# Altium schematic sheet 68.Ethernet-GEPHY_RGMII1.SchDoc
size 420 x 297 mm; Revision: V2.1; Schematic Page Number: 11; Page Number: 32; Check: Default; Schematic Name: RK_NVR_DEMO1_RK3588_LP4/4x_V21; Page Count: 43; Page name: 68.Ethernet-GEPHY_RGMII1; Designer: Zhangdz; Schematic Page Count: 99; Revcode: V2.1; DsnPath: E:\Work\SBER\RK3588_SOM\temp\RK_NVR_DEMO1_RK3588_LP4XD200P232SD8_V21_20211228.DSN; SchematicName: RK_NVR_DEMO1_RK3588_LP4/4x_V21; PageName: 68.Ethernet-GEPHY_RGMII1; PageSize: A3; TopSchematic: True
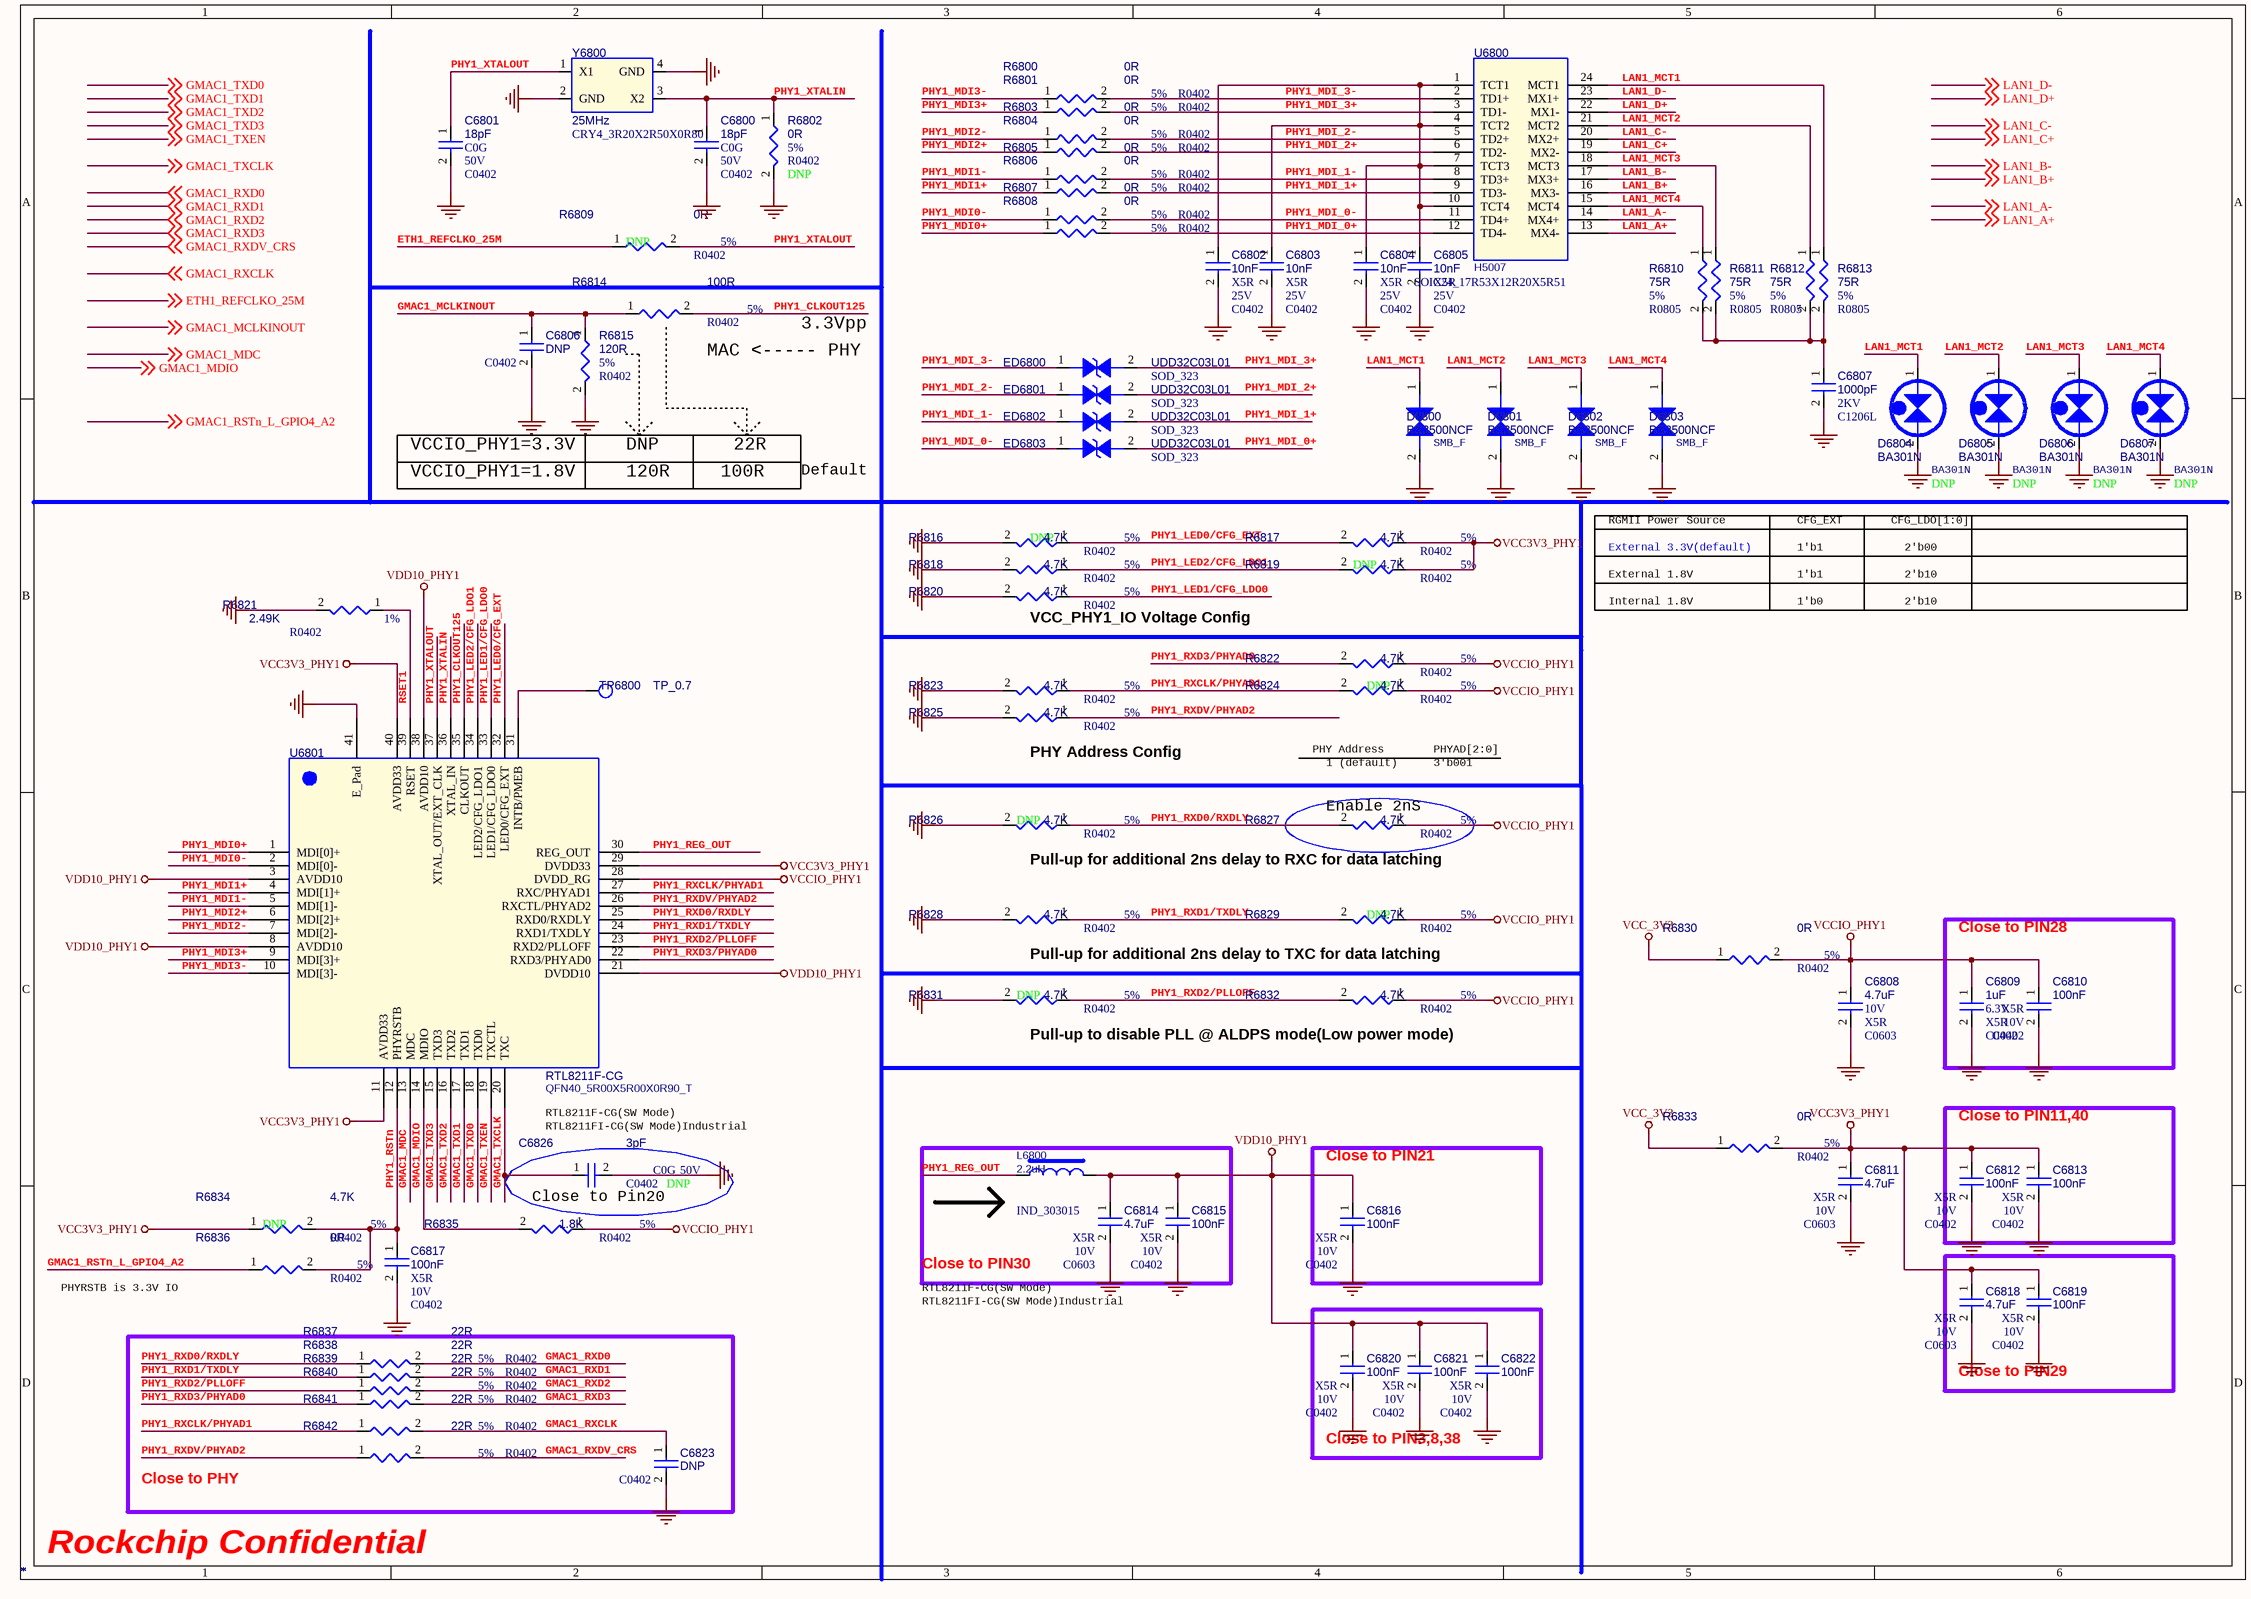
[diagram p0: 68.Ethernet-GEPHY_RGMII1.SchDoc]

## Parts
C6800  *  Voltage: 50V  Dielectric: C0G  [C0402]
C6801  *  Voltage: 50V  Dielectric: C0G  [C0402]
C6802  *  Voltage: 25V  Dielectric: X5R  [C0402]
C6803  *  Voltage: 25V  Dielectric: X5R  [C0402]
C6804  *  Voltage: 25V  Dielectric: X5R  [C0402]
C6805  *  Voltage: 25V  Dielectric: X5R  [C0402]
C6806  *  [C0402]
C6807  *  Voltage: 2KV  [C1206L]
C6808  *  Voltage: 10V  Dielectric: X5R  [C0603]
C6809  *  Voltage: 6.3V  Dielectric: X5R  [C0402]
C6810  *  Voltage: 10V  Dielectric: X5R  [C0402]
C6811  *  Voltage: 10V  Dielectric: X5R  [C0603]
C6812  *  Voltage: 10V  Dielectric: X5R  [C0402]
C6813  *  Voltage: 10V  Dielectric: X5R  [C0402]
C6814  *  Voltage: 10V  Dielectric: X5R  [C0603]
C6815  *  Voltage: 10V  Dielectric: X5R  [C0402]
C6816  *  Voltage: 10V  Dielectric: X5R  [C0402]
C6817  *  Voltage: 10V  Dielectric: X5R  [C0402]
C6818  *  Voltage: 10V  Dielectric: X5R  [C0603]
C6819  *  Voltage: 10V  Dielectric: X5R  [C0402]
C6820  *  Voltage: 10V  Dielectric: X5R  [C0402]
C6821  *  Voltage: 10V  Dielectric: X5R  [C0402]
C6822  *  Voltage: 10V  Dielectric: X5R  [C0402]
C6823  *  [C0402]
C6826  *  Voltage: 50V  Dielectric: C0G  option: DNP  [C0402]
D6800  *  PCB Footprint: SMB_F  [BA301N]
D6801  *  PCB Footprint: SMB_F  [BA301N]
D6802  *  PCB Footprint: SMB_F  [BA301N]
D6803  *  PCB Footprint: SMB_F  [BA301N]
D6804  *  option: DNP  [BA301N]
D6805  *  option: DNP  [BA301N]
D6806  *  option: DNP  [BA301N]
D6807  *  option: DNP  [BA301N]
ED6800  *  [SOD_323]
ED6801  *  [SOD_323]
ED6802  *  [SOD_323]
ED6803  *  [SOD_323]
L6800  *  [IND_303015]
R6800  *  Tolerance: 5%  [R0402]
R6801  *  Tolerance: 5%  [R0402]
R6802  *  Tolerance: 5%  option: DNP  [R0402]
R6803  *  Tolerance: 5%  [R0402]
R6804  *  Tolerance: 5%  [R0402]
R6805  *  Tolerance: 5%  [R0402]
R6806  *  Tolerance: 5%  [R0402]
R6807  *  Tolerance: 5%  [R0402]
R6808  *  Tolerance: 5%  [R0402]
R6809  *  Tolerance: 5%  Option: DNP  [R0402]
R6810  *  PCB Footprint: R0805  Tolerance: 5%  [R0402]
R6811  *  PCB Footprint: R0805  Tolerance: 5%  [R0402]
R6812  *  PCB Footprint: R0805  Tolerance: 5%  [R0402]
R6813  *  PCB Footprint: R0805  Tolerance: 5%  [R0402]
R6814  *  Tolerance: 5%  [R0402]
R6815  *  Tolerance: 5%  [R0402]
R6816  *  Tolerance: 5%  option: DNP  [R0402]
R6817  *  Tolerance: 5%  [R0402]
R6818  *  Tolerance: 5%  [R0402]
R6819  *  Tolerance: 5%  option: DNP  [R0402]
R6820  *  Tolerance: 5%  [R0402]
R6821  *  Tolerance: 1%  [R0402]
R6822  *  Tolerance: 5%  [R0402]
R6823  *  Tolerance: 5%  [R0402]
R6824  *  Tolerance: 5%  option: DNP  [R0402]
R6825  *  Tolerance: 5%  [R0402]
R6826  *  Tolerance: 5%  option: DNP  [R0402]
R6827  *  Tolerance: 5%  [R0402]
R6828  *  Tolerance: 5%  [R0402]
R6829  *  Tolerance: 5%  option: DNP  [R0402]
R6830  *  Tolerance: 5%  [R0402]
R6831  *  Tolerance: 5%  option: DNP  [R0402]
R6832  *  Tolerance: 5%  [R0402]
R6833  *  Tolerance: 5%  [R0402]
R6834  *  Tolerance: 5%  Option: DNP  [R0402]
R6835  *  Tolerance: 5%  [R0402]
R6836  *  Tolerance: 5%  [R0402]
R6837  *  Tolerance: 5%  [R0402]
R6838  *  Tolerance: 5%  [R0402]
R6839  *  Tolerance: 5%  [R0402]
R6840  *  Tolerance: 5%  [R0402]
R6841  *  Tolerance: 5%  [R0402]
R6842  *  Tolerance: 5%  [R0402]
TP6800  *  [TEST]
U6800  *  [SOIC24_17R53X12R20X5R51]
U6801  *  PCB Footprint: QFN40_5R00X5R00X0R90_T  [QFN40_5R00X5R00X0R80_T]
Y6800  *  PCB Footprint: CRY4_3R20X2R50X0R80  [CRY-3225]

## Blocks framed on the sheet
Close to PIN28: C6809 C6810
Close to PIN11,40: C6812 C6813
Close to PIN30: C6814 C6815 L6800
Close to PIN21: C6816
Close to PIN29: C6818 C6819
Close to PIN3,8,38: C6820-C6822
Close to PHY: C6823 R6837-R6842

## Nets
GND: C6800.2 C6801.2 C6802.2 C6803.2 C6804.2 C6805.2 C6806.2 C6807.2 C6808.2 C6809.2 C6810.2 C6811.2 C6812.2 C6813.2 C6814.2 C6815.2 C6816.2 C6817.2 C6818.2 C6819.2 C6820.2 C6821.2 C6822.2 C6823.2 C6826.2 D6800.2 D6801.2 D6802.2 D6803.2 D6804.2 D6805.2 D6806.2 D6807.2 R6802.2 R6815.2 R6816.2 R6818.2 R6820.2 R6821.2 R6823.2 R6825.2 R6826.2 R6828.2 R6831.2 U6801.41(E_Pad) Y6800.2(GND) Y6800.4(GND)
VCC3V3_PHY1: C6811.1 C6812.1 C6813.1 C6818.1 C6819.1 R6817.1 R6819.1 R6833.2 R6834.1 U6801.11(AVDD33) U6801.29(DVDD33) U6801.40(AVDD33)
VCC_3V3: R6830.1 R6833.1
VCCIO_PHY1: C6808.1 C6809.1 C6810.1 R6822.1 R6824.1 R6827.1 R6829.1 R6830.2 R6832.1 R6835.1 U6801.28(DVDD_RG)
VDD10_PHY1: C6814.1 C6815.1 C6816.1 C6820.1 C6821.1 C6822.1 L6800.2 U6801.3(AVDD10) U6801.8(AVDD10) U6801.21(DVDD10) U6801.38(AVDD10)
ETH1_REFCLKO_25M: R6809.1 ; off-sheet ETH1_REFCLKO_25M
GMAC1_MCLKINOUT: C6806.1 R6814.1 R6815.1 ; off-sheet GMAC1_MCLKINOUT
GMAC1_MDC: U6801.13(MDC) ; off-sheet GMAC1_MDC
GMAC1_MDIO: R6835.2 U6801.14(MDIO) ; off-sheet GMAC1_MDIO
GMAC1_RSTn_L_GPIO4_A2: R6836.1 ; off-sheet GMAC1_RSTn_L_GPIO4_A2
GMAC1_RXCLK: C6823.1 R6841.2 ; off-sheet GMAC1_RXCLK
GMAC1_RXD0: R6837.2 ; off-sheet GMAC1_RXD0
GMAC1_RXD1: R6838.2 ; off-sheet GMAC1_RXD1
GMAC1_RXD2: R6839.2 ; off-sheet GMAC1_RXD2
GMAC1_RXD3: R6840.2 ; off-sheet GMAC1_RXD3
GMAC1_RXDV_CRS: R6842.2 ; off-sheet GMAC1_RXDV_CRS
GMAC1_TXCLK: C6826.1 U6801.20(TXC) ; off-sheet GMAC1_TXCLK
GMAC1_TXD0: U6801.18(TXD0) ; off-sheet GMAC1_TXD0
GMAC1_TXD1: U6801.17(TXD1) ; off-sheet GMAC1_TXD1
GMAC1_TXD2: U6801.16(TXD2) ; off-sheet GMAC1_TXD2
GMAC1_TXD3: U6801.15(TXD3) ; off-sheet GMAC1_TXD3
GMAC1_TXEN: U6801.19(TXCTL) ; off-sheet GMAC1_TXEN
LAN1_A+: U6800.13(MX4-) ; off-sheet LAN1_A+
LAN1_A-: U6800.14(MX4+) ; off-sheet LAN1_A-
LAN1_B+: U6800.16(MX3-) ; off-sheet LAN1_B+
LAN1_B-: U6800.17(MX3+) ; off-sheet LAN1_B-
LAN1_C+: U6800.19(MX2-) ; off-sheet LAN1_C+
LAN1_C-: U6800.20(MX2+) ; off-sheet LAN1_C-
LAN1_D+: U6800.22(MX1-) ; off-sheet LAN1_D+
LAN1_D-: U6800.23(MX1+) ; off-sheet LAN1_D-
LAN1_MCT1: D6800.1 D6804.1 R6813.1 U6800.24(MCT1)
LAN1_MCT2: D6801.1 D6805.1 R6812.1 U6800.21(MCT2)
LAN1_MCT3: D6802.1 D6806.1 R6811.1 U6800.18(MCT3)
LAN1_MCT4: D6803.1 D6807.1 R6810.1 U6800.15(MCT4)
PHY1_CLKOUT125: R6814.2 U6801.35(CLKOUT)
PHY1_LED0/CFG_EXT: R6816.1 R6817.2 U6801.32(LED0/CFG_EXT)
PHY1_LED1/CFG_LDO0: R6820.1 U6801.33(LED1/CFG_LDO0)
PHY1_LED2/CFG_LDO1: R6818.1 R6819.2 U6801.34(LED2/CFG_LDO1)
PHY1_MDI0+: R6808.1 U6801.1(MDI[0]+)
PHY1_MDI0-: R6807.1 U6801.2(MDI[0]-)
PHY1_MDI1+: R6806.1 U6801.4(MDI[1]+)
PHY1_MDI1-: R6805.1 U6801.5(MDI[1]-)
PHY1_MDI2+: R6804.1 U6801.6(MDI[2]+)
PHY1_MDI2-: R6803.1 U6801.7(MDI[2]-)
PHY1_MDI3+: R6801.1 U6801.9(MDI[3]+)
PHY1_MDI3-: R6800.1 U6801.10(MDI[3]-)
PHY1_MDI_0+: ED6803.2 R6808.2 U6800.12(TD4-)
PHY1_MDI_0-: ED6803.1 R6807.2 U6800.11(TD4+)
PHY1_MDI_1+: ED6802.2 R6806.2 U6800.9(TD3-)
PHY1_MDI_1-: ED6802.1 R6805.2 U6800.8(TD3+)
PHY1_MDI_2+: ED6801.2 R6804.2 U6800.6(TD2-)
PHY1_MDI_2-: ED6801.1 R6803.2 U6800.5(TD2+)
PHY1_MDI_3+: ED6800.2 R6801.2 U6800.3(TD1-)
PHY1_MDI_3-: ED6800.1 R6800.2 U6800.2(TD1+)
PHY1_REG_OUT: L6800.1 U6801.30(REG_OUT)
PHY1_RSTn: C6817.1 R6834.2 R6836.2 U6801.12(PHYRSTB)
PHY1_RXCLK/PHYAD1: R6823.1 R6824.2 R6841.1 U6801.27(RXC/PHYAD1)
PHY1_RXD0/RXDLY: R6826.1 R6827.2 R6837.1 U6801.25(RXD0/RXDLY)
PHY1_RXD1/TXDLY: R6828.1 R6829.2 R6838.1 U6801.24(RXD1/TXDLY)
PHY1_RXD2/PLLOFF: R6831.1 R6832.2 R6839.1 U6801.23(RXD2/PLLOFF)
PHY1_RXD3/PHYAD0: R6822.2 R6840.1 U6801.22(RXD3/PHYAD0)
PHY1_RXDV/PHYAD2: R6825.1 R6842.1 U6801.26(RXCTL/PHYAD2)
PHY1_XTALIN: C6800.1 R6802.1 U6801.36(XTAL_IN) Y6800.3(X2)
PHY1_XTALOUT: C6801.1 R6809.2 U6801.37(XTAL_OUT/EXT_CLK) Y6800.1(X1)
RSET1: R6821.1 U6801.39(RSET)
NetC6802_1: C6802.1 C6803.1 C6804.1 C6805.1 U6800.1(TCT1) U6800.4(TCT2) U6800.7(TCT3) U6800.10(TCT4)
NetC6807_1: C6807.1 R6810.2 R6811.2 R6812.2 R6813.2
NetTP6800_1: TP6800.1 U6801.31(INTB/PMEB)

## Notes on the sheet
- (near R6814) MAC <----- PHY
- 3.3Vpp
- VCCIO_PHY1=3.3V
- DNP
- 22R
- VCCIO_PHY1=1.8V
- 120R
- 100R
- Default
- RGMII Power Source
- CFG_EXT
- CFG_LDO[1:0]
- External 3.3V(default)
- External 1.8V
- 1'b1
- 2'b00
- 2'b10
- (near R6820) VCC_PHY1_IO Voltage Config
- Internal 1.8V
- 1'b0
- (near R6825) PHY Address Config
- PHY Address
- 1 (default)
- PHYAD[2:0]
- 3'b001
- Pull-up for additional 2ns delay to RXC for data latching
- (near R6827) Enable 2nS
- Pull-up for additional 2ns delay to TXC for data latching
- Pull-up to disable PLL @ ALDPS mode(Low power mode)
- RTL8211F-CG(SW Mode)
- RTL8211FI-CG(SW Mode)Industrial
- Close to Pin20
- PHYRSTB is 3.3V IO
- Rockchip Confidential

## Library data of the parts
C6800 = CAP NP: cap,18.00pF,+/-5%,50V,C0G,C0402; Part Reference: C6800; Manufacturer: TDK; Value: 18pF; RK PN: C1005C0G1H180J050BA; Priority: A; Tolerance: 5%; PCB Footprint: C0402; Part Type: C0402; Manufacturer PN: C1005C0G1H180J050BA; Created by: JJJ
C6801 = CAP NP: cap,18.00pF,+/-5%,50V,C0G,C0402; Part Reference: C6801; Manufacturer: TDK; Value: 18pF; RK PN: C1005C0G1H180J050BA; Priority: A; Tolerance: 5%; PCB Footprint: C0402; Part Type: C0402; Manufacturer PN: C1005C0G1H180J050BA; Created by: JJJ
C6802 = CAP NP: cap,10.00nF,+/-10%,25V,X5R,C0402; Part Reference: C6802; Manufacturer PN: C1005X5R1E103K050BA; Manufacturer: TDK; Value: 10nF; Tolerance: 10%; Priority: A; PCB Footprint: C0402; Created by: JJJ; Part Type: C0402; RK PN: C1005X5R1E103K050BA
C6803 = CAP NP: cap,10.00nF,+/-10%,25V,X5R,C0402; Part Reference: C6803; Manufacturer PN: C1005X5R1E103K050BA; Manufacturer: TDK; Value: 10nF; Tolerance: 10%; Priority: A; PCB Footprint: C0402; Created by: JJJ; Part Type: C0402; RK PN: C1005X5R1E103K050BA
C6804 = CAP NP: cap,10.00nF,+/-10%,25V,X5R,C0402; Part Reference: C6804; Manufacturer: TDK; Value: 10nF; RK PN: C1005X5R1E103K050BA; Priority: A; Tolerance: 10%; PCB Footprint: C0402; Part Type: C0402; Manufacturer PN: C1005X5R1E103K050BA; Created by: JJJ
C6805 = CAP NP: cap,10.00nF,+/-10%,25V,X5R,C0402; Part Reference: C6805; Manufacturer: TDK; Value: 10nF; RK PN: C1005X5R1E103K050BA; Priority: A; Tolerance: 10%; PCB Footprint: C0402; Part Type: C0402; Manufacturer PN: C1005X5R1E103K050BA; Created by: JJJ
C6806 = CAP NP: Did Not Place.; Part Reference: C6806; Value: DNP; Number: 37; RK PN: DNPC0402; Priority: A; C_Voltage: 6.3V; PCB Footprint: C0402; Part Type: DNP; Manufacturer PN: DNPC0402; Created by: JJJ
C6807 = CAP NP: ёЯС№µзИЭ,1000pF/2KV,C1206; Part Reference: C6807; Value: 1000pF; RK PN: CTY1AC250V2E4102M2B; Priority: A; Tolerance: 20%; PCB Footprint: C1206L; Part Type: ёЯС№µзИЭ; Manufacturer PN: CTY1AC250V2E4102M2B; Created by: JJJ
C6808 = CAP NP: cap,4.70uF,+/-10%,10V,X5R,C0603; Part Reference: C6808; Manufacturer: TDK; Value: 4.7uF; RK PN: C1608X5R1A475K080AC; Priority: A; C_Voltage: 6.3V; Tolerance: 10%; PCB Footprint: C0603; Part Type: C0603; Manufacturer PN: C1608X5R1A475K080AC; Created by: JJJ
C6809 = CAP NP: cap,1.00uF,+/-10%,6.3V,X5R,C0402; Part Reference: C6809; Manufacturer: TDK; Value: 1uF; RK PN: C1005X5R0J105K050BB; Priority: A; Tolerance: 10%; PCB Footprint: C0402; Part Type: C0402; C_Voltage: 6.3V; Manufacturer PN: C1005X5R0J105K050BB; Created by: JJJ
C6810 = CAP NP: cap,100.00nF,+/-10%,10V,X5R,C0402; Part Reference: C6810; Manufacturer: TDK; Value: 100nF; Number: 37; RK PN: C1005X5R1A104K050BA; Priority: A; Tolerance: 10%; C_Voltage: 6.3V; PCB Footprint: C0402; Part Type: C0402; Manufacturer PN: C1005X5R1A104K050BA; Created by: JJJ
C6811 = CAP NP: cap,4.70uF,+/-10%,10V,X5R,C0603; Part Reference: C6811; Manufacturer PN: C1608X5R1A475K080AC; Manufacturer: TDK; Value: 4.7uF; Tolerance: 10%; C_Voltage: 6.3V; Priority: A; PCB Footprint: C0603; Created by: JJJ; Part Type: C0603; RK PN: C1608X5R1A475K080AC
C6812 = CAP NP: cap,100.00nF,+/-10%,10V,X5R,C0402; Part Reference: C6812; Manufacturer: TDK; Value: 100nF; Number: 37; RK PN: C1005X5R1A104K050BA; Priority: A; Tolerance: 10%; C_Voltage: 6.3V; PCB Footprint: C0402; Part Type: C0402; Manufacturer PN: C1005X5R1A104K050BA; Created by: JJJ
C6813 = CAP NP: cap,100.00nF,+/-10%,10V,X5R,C0402; Part Reference: C6813; Manufacturer: TDK; Value: 100nF; Number: 37; RK PN: C1005X5R1A104K050BA; Priority: A; Tolerance: 10%; C_Voltage: 6.3V; PCB Footprint: C0402; Part Type: C0402; Manufacturer PN: C1005X5R1A104K050BA; Created by: JJJ
C6814 = CAP NP: cap,4.70uF,+/-10%,10V,X5R,C0603; Part Reference: C6814; Manufacturer PN: C1608X5R1A475K080AC; Manufacturer: TDK; Value: 4.7uF; Tolerance: 10%; C_Voltage: 6.3V; Priority: A; PCB Footprint: C0603; Created by: JJJ; Part Type: C0603; RK PN: C1608X5R1A475K080AC
C6815 = CAP NP: cap,100.00nF,+/-10%,10V,X5R,C0402; Part Reference: C6815; Manufacturer PN: C1005X5R1A104K050BA; Manufacturer: TDK; Value: 100nF; C_Voltage: 6.3V; Tolerance: 10%; Priority: A; Number: 37; PCB Footprint: C0402; Created by: JJJ; Part Type: C0402; RK PN: C1005X5R1A104K050BA
C6816 = CAP NP: cap,100.00nF,+/-10%,10V,X5R,C0402; Part Reference: C6816; Manufacturer PN: C1005X5R1A104K050BA; Manufacturer: TDK; Value: 100nF; C_Voltage: 6.3V; Tolerance: 10%; Priority: A; Number: 37; PCB Footprint: C0402; Created by: JJJ; Part Type: C0402; RK PN: C1005X5R1A104K050BA
C6817 = CAP NP: cap,100.00nF,+/-10%,10V,X5R,C0402; Part Reference: C6817; Manufacturer PN: C1005X5R1A104K050BA; Manufacturer: TDK; Value: 100nF; Tolerance: 10%; Priority: A; PCB Footprint: C0402; Created by: JJJ; Part Type: C0402; RK PN: C1005X5R1A104K050BA
C6818 = CAP NP: cap,4.70uF,+/-10%,10V,X5R,C0603; Part Reference: C6818; Manufacturer PN: C1608X5R1A475K080AC; Manufacturer: TDK; Value: 4.7uF; Tolerance: 10%; C_Voltage: 6.3V; Priority: A; PCB Footprint: C0603; Created by: JJJ; Part Type: C0603; RK PN: C1608X5R1A475K080AC
C6819 = CAP NP: cap,100.00nF,+/-10%,10V,X5R,C0402; Part Reference: C6819; Manufacturer: TDK; Value: 100nF; Number: 37; RK PN: C1005X5R1A104K050BA; Priority: A; Tolerance: 10%; C_Voltage: 6.3V; PCB Footprint: C0402; Part Type: C0402; Manufacturer PN: C1005X5R1A104K050BA; Created by: JJJ
C6820 = CAP NP: cap,100.00nF,+/-10%,10V,X5R,C0402; Part Reference: C6820; Manufacturer: TDK; Value: 100nF; Number: 37; RK PN: C1005X5R1A104K050BA; Priority: A; Tolerance: 10%; C_Voltage: 6.3V; PCB Footprint: C0402; Part Type: C0402; Manufacturer PN: C1005X5R1A104K050BA; Created by: JJJ
C6821 = CAP NP: cap,100.00nF,+/-10%,10V,X5R,C0402; Part Reference: C6821; Manufacturer: TDK; Value: 100nF; Number: 37; RK PN: C1005X5R1A104K050BA; Priority: A; Tolerance: 10%; C_Voltage: 6.3V; PCB Footprint: C0402; Part Type: C0402; Manufacturer PN: C1005X5R1A104K050BA; Created by: JJJ
C6822 = CAP NP: cap,100.00nF,+/-10%,10V,X5R,C0402; Part Reference: C6822; Manufacturer: TDK; Value: 100nF; Number: 37; RK PN: C1005X5R1A104K050BA; Priority: A; Tolerance: 10%; C_Voltage: 6.3V; PCB Footprint: C0402; Part Type: C0402; Manufacturer PN: C1005X5R1A104K050BA; Created by: JJJ
C6823 = CAP NP: Did Not Place.; Part Reference: C6823; Manufacturer PN: DNPC0402; Value: DNP; C_Voltage: 6.3V; Priority: A; Number: 37; PCB Footprint: C0402; Created by: JJJ; Part Type: DNP; RK PN: DNPC0402
C6826 = CAP NP: cap,3.00pF,+/-0.25,50V,C0G,C0402; Part Reference: C6826; Manufacturer: TDK; Value: 3pF; RK PN: C1005C0G1H030C050BA; Priority: A; Tolerance: +/-0.25pF; PCB Footprint: C0402; Part Type: C0402; Manufacturer PN: C1005C0G1H030C050BA; Created by: JJJ
D6800 = BA301N_3: Part Reference: D6800; Value: BS3500NCF
D6801 = BA301N_3: Part Reference: D6801; Value: BS3500NCF
D6802 = BA301N_3: Part Reference: D6802; Value: BS3500NCF
D6803 = BA301N_3: Part Reference: D6803; Value: BS3500NCF
D6804 = BA301N_1: Part Reference: D6804; Value: BA301N; PCB Footprint: BA301N
D6805 = BA301N_1: Part Reference: D6805; Value: BA301N; PCB Footprint: BA301N
D6806 = BA301N_1: Part Reference: D6806; Value: BA301N; PCB Footprint: BA301N
D6807 = BA301N_1: Part Reference: D6807; Value: BA301N; PCB Footprint: BA301N
ED6800 = DIODE BI_DIR TRIG: Transient Voltage Suppressor,0.8pF; Part Reference: ED6800; Manufacturer: WillSemi(О¤¶ы°лµјМе); Value: UDD32C03L01; RK PN: ESD5451N; Priority: A; PCB Footprint: SOD_323; Part Type: ESD_TVS; Manufacturer PN: ESD5451N; Created by: JJJ
ED6801 = DIODE BI_DIR TRIG: Transient Voltage Suppressor,0.8pF; Part Reference: ED6801; Manufacturer: WillSemi(О¤¶ы°лµјМе); Value: UDD32C03L01; RK PN: ESD5451N; Priority: A; PCB Footprint: SOD_323; Part Type: ESD_TVS; Manufacturer PN: ESD5451N; Created by: JJJ
ED6802 = DIODE BI_DIR TRIG: Transient Voltage Suppressor,0.8pF; Part Reference: ED6802; Manufacturer: WillSemi(О¤¶ы°лµјМе); Value: UDD32C03L01; RK PN: ESD5451N; Priority: A; PCB Footprint: SOD_323; Part Type: ESD_TVS; Manufacturer PN: ESD5451N; Created by: JJJ
ED6803 = DIODE BI_DIR TRIG: Transient Voltage Suppressor,0.8pF; Part Reference: ED6803; Manufacturer: WillSemi(О¤¶ы°лµјМе); Value: UDD32C03L01; RK PN: ESD5451N; Priority: A; PCB Footprint: SOD_323; Part Type: ESD_TVS; Manufacturer PN: ESD5451N; Created by: JJJ
L6800 = INDUCTORS OF FERRITE_Dup1: Power Inductor,2.2uH,0.3,IND_303015; Part Reference: L6800; Manufacturer PN: SWPA3015S2R2NT; Manufacturer: sunlord; Isat: 1.6A; DC Resistor: 0.06ohm; Resonace frequency: 86M; Tolerance: 30%; Priority: A; PCB Footprint: IND_303015; Value: 2.2uH; Created by: YTL; Irms: 1.6A; Part Type: POWER_IND; RK PN: SWPA3015S2R2NT
R6800 = RESISTOR_Dup1: НЁУГєсД¤µзЧи,0R,+/-5%,R0402,1/16W.; Part Reference: R6800; Manufacturer: YAGEO; RK PN: RC0402JR-070RL; Priority: A; Wattage: 1/16W; PCB Footprint: R0402; Value: 0R; Part Type: НЁУГєсД¤µзЧи; Manufacturer PN: RC0402JR-070RL; Created by: YTL
R6801 = RESISTOR_Dup1: НЁУГєсД¤µзЧи,0R,+/-5%,R0402,1/16W.; Part Reference: R6801; Manufacturer: YAGEO; RK PN: RC0402JR-070RL; Priority: A; Wattage: 1/16W; PCB Footprint: R0402; Value: 0R; Part Type: НЁУГєсД¤µзЧи; Manufacturer PN: RC0402JR-070RL; Created by: YTL
R6802 = RESISTOR_Dup1: НЁУГєсД¤µзЧи,0R,+/-5%,R0402,1/16W.; Part Reference: R6802; Manufacturer: YAGEO; RK PN: RC0402JR-070RL; Priority: A; Wattage: 1/16W; PCB Footprint: R0402; Value: 0R; Part Type: НЁУГєсД¤µзЧи; Manufacturer PN: RC0402JR-070RL; Created by: YTL
R6803 = RESISTOR_Dup1: НЁУГєсД¤µзЧи,0R,+/-5%,R0402,1/16W.; Part Reference: R6803; Manufacturer: YAGEO; RK PN: RC0402JR-070RL; Priority: A; Wattage: 1/16W; PCB Footprint: R0402; Value: 0R; Part Type: НЁУГєсД¤µзЧи; Manufacturer PN: RC0402JR-070RL; Created by: YTL
R6804 = RESISTOR_Dup1: НЁУГєсД¤µзЧи,0R,+/-5%,R0402,1/16W.; Part Reference: R6804; Manufacturer: YAGEO; RK PN: RC0402JR-070RL; Priority: A; Wattage: 1/16W; PCB Footprint: R0402; Value: 0R; Part Type: НЁУГєсД¤µзЧи; Manufacturer PN: RC0402JR-070RL; Created by: YTL
R6805 = RESISTOR_Dup1: НЁУГєсД¤µзЧи,0R,+/-5%,R0402,1/16W.; Part Reference: R6805; Manufacturer: YAGEO; RK PN: RC0402JR-070RL; Priority: A; Wattage: 1/16W; PCB Footprint: R0402; Value: 0R; Part Type: НЁУГєсД¤µзЧи; Manufacturer PN: RC0402JR-070RL; Created by: YTL
R6806 = RESISTOR_Dup1: НЁУГєсД¤µзЧи,0R,+/-5%,R0402,1/16W.; Part Reference: R6806; Manufacturer: YAGEO; RK PN: RC0402JR-070RL; Priority: A; Wattage: 1/16W; PCB Footprint: R0402; Value: 0R; Part Type: НЁУГєсД¤µзЧи; Manufacturer PN: RC0402JR-070RL; Created by: YTL
R6807 = RESISTOR_Dup1: НЁУГєсД¤µзЧи,0R,+/-5%,R0402,1/16W.; Part Reference: R6807; Manufacturer: YAGEO; RK PN: RC0402JR-070RL; Priority: A; Wattage: 1/16W; PCB Footprint: R0402; Value: 0R; Part Type: НЁУГєсД¤µзЧи; Manufacturer PN: RC0402JR-070RL; Created by: YTL
R6808 = RESISTOR_Dup1: НЁУГєсД¤µзЧи,0R,+/-5%,R0402,1/16W.; Part Reference: R6808; Manufacturer: YAGEO; RK PN: RC0402JR-070RL; Priority: A; Wattage: 1/16W; PCB Footprint: R0402; Value: 0R; Part Type: НЁУГєсД¤µзЧи; Manufacturer PN: RC0402JR-070RL; Created by: YTL
R6809 = RESISTOR_Dup1: НЁУГєсД¤µзЧи,0R,+/-5%,R0402,1/16W.; Part Reference: R6809; Manufacturer: YAGEO; RK PN: RC0402JR-070RL; Priority: A; Wattage: 1/16W; PCB Footprint: R0402; Value: 0R; Part Type: НЁУГєсД¤µзЧи; Manufacturer PN: RC0402JR-070RL; Created by: YTL
R6810 = RESISTOR_Dup1: НЁУГєсД¤µзЧи,75R,+/-5%,R0805,1/8W.; Part Reference: R6810; Manufacturer PN: RC0805JR-0775RL; Manufacturer: YAGEO; Wattage: 1/8W; Priority: A; Value: 75R; Created by: YTL; Part Type: НЁУГєсД¤µзЧи; RK PN: RC0805JR-0775RL
R6811 = RESISTOR_Dup1: НЁУГєсД¤µзЧи,75R,+/-5%,R0805,1/8W.; Part Reference: R6811; Manufacturer PN: RC0805JR-0775RL; Manufacturer: YAGEO; Wattage: 1/8W; Priority: A; Value: 75R; Created by: YTL; Part Type: НЁУГєсД¤µзЧи; RK PN: RC0805JR-0775RL
R6812 = RESISTOR_Dup1: НЁУГєсД¤µзЧи,75R,+/-5%,R0805,1/8W.; Part Reference: R6812; Manufacturer PN: RC0805JR-0775RL; Manufacturer: YAGEO; Wattage: 1/8W; Priority: A; Value: 75R; Created by: YTL; Part Type: НЁУГєсД¤µзЧи; RK PN: RC0805JR-0775RL
R6813 = RESISTOR_Dup1: НЁУГєсД¤µзЧи,75R,+/-5%,R0805,1/8W.; Part Reference: R6813; Manufacturer PN: RC0805JR-0775RL; Manufacturer: YAGEO; Wattage: 1/8W; Priority: A; Value: 75R; Created by: YTL; Part Type: НЁУГєсД¤µзЧи; RK PN: RC0805JR-0775RL
R6814 = RESISTOR_Dup1: НЁУГєсД¤µзЧи,100R,+/-5%,R0402,1/16W.; Part Reference: R6814; Manufacturer PN: RC0402JR-07100RL; Manufacturer: YAGEO; Wattage: 1/16W; Priority: A; PCB Footprint: R0402; Value: 100R; Created by: YTL; Part Type: НЁУГєсД¤µзЧи; RK PN: RC0402JR-07100RL
R6815 = RESISTOR_Dup1: НЁУГєсД¤µзЧи,120R,+/-5%,R0402,1/16W.; Part Reference: R6815; Manufacturer: YAGEO; RK PN: RC0402JR-07120RL; Priority: A; Wattage: 1/16W; PCB Footprint: R0402; Value: 120R; Part Type: НЁУГєсД¤µзЧи; Manufacturer PN: RC0402JR-07120RL; Created by: YTL
R6816 = RESISTOR_Dup1: НЁУГєсД¤µзЧи,4K7,+/-5%,R0402,1/16W.; Part Reference: R6816; Manufacturer: YAGEO; Value: 4.7K; RK PN: RC0402JR-074K7L; Priority: A; Wattage: 1/16W; PCB Footprint: R0402; Part Type: НЁУГєсД¤µзЧи; Manufacturer PN: RC0402JR-074K7L; Created by: YTL
R6817 = RESISTOR_Dup1: НЁУГєсД¤µзЧи,4K7,+/-5%,R0402,1/16W.; Part Reference: R6817; Manufacturer: YAGEO; Value: 4.7K; RK PN: RC0402JR-074K7L; Priority: A; Wattage: 1/16W; PCB Footprint: R0402; Part Type: НЁУГєсД¤µзЧи; Manufacturer PN: RC0402JR-074K7L; Created by: YTL
R6818 = RESISTOR_Dup1: НЁУГєсД¤µзЧи,4K7,+/-5%,R0402,1/16W.; Part Reference: R6818; Manufacturer: YAGEO; Value: 4.7K; RK PN: RC0402JR-074K7L; Priority: A; Wattage: 1/16W; PCB Footprint: R0402; Part Type: НЁУГєсД¤µзЧи; Manufacturer PN: RC0402JR-074K7L; Created by: YTL
R6819 = RESISTOR_Dup1: НЁУГєсД¤µзЧи,4K7,+/-5%,R0402,1/16W.; Part Reference: R6819; Manufacturer PN: RC0402JR-074K7L; Manufacturer: YAGEO; Value: 4.7K; Wattage: 1/16W; Priority: A; PCB Footprint: R0402; Created by: YTL; Part Type: НЁУГєсД¤µзЧи; RK PN: RC0402JR-074K7L
R6820 = RESISTOR_Dup1: НЁУГєсД¤µзЧи,4K7,+/-5%,R0402,1/16W.; Part Reference: R6820; Manufacturer PN: RC0402JR-074K7L; Manufacturer: YAGEO; Value: 4.7K; Wattage: 1/16W; Priority: A; PCB Footprint: R0402; Created by: YTL; Part Type: НЁУГєсД¤µзЧи; RK PN: RC0402JR-074K7L
R6821 = RESISTOR_Dup1: НЁУГєсД¤µзЧи,2K49,+/-1%,R0402,1/16W.; Part Reference: R6821; Manufacturer PN: RC0402FR-072K49L; Manufacturer: YAGEO; Value: 2.49K; Wattage: 1/16W; Priority: A; PCB Footprint: R0402; Created by: YTL; Part Type: НЁУГєсД¤µзЧи; RK PN: RC0402FR-072K49L
R6822 = RESISTOR_Dup1: НЁУГєсД¤µзЧи,4K7,+/-5%,R0402,1/16W.; Part Reference: R6822; Manufacturer: YAGEO; Value: 4.7K; RK PN: RC0402JR-074K7L; Priority: A; Wattage: 1/16W; PCB Footprint: R0402; Part Type: НЁУГєсД¤µзЧи; Manufacturer PN: RC0402JR-074K7L; Created by: YTL
R6823 = RESISTOR_Dup1: НЁУГєсД¤µзЧи,4K7,+/-5%,R0402,1/16W.; Part Reference: R6823; Manufacturer PN: RC0402JR-074K7L; Manufacturer: YAGEO; Value: 4.7K; Wattage: 1/16W; Priority: A; PCB Footprint: R0402; Created by: YTL; Part Type: НЁУГєсД¤µзЧи; RK PN: RC0402JR-074K7L
R6824 = RESISTOR_Dup1: НЁУГєсД¤µзЧи,4K7,+/-5%,R0402,1/16W.; Part Reference: R6824; Manufacturer: YAGEO; Value: 4.7K; RK PN: RC0402JR-074K7L; Priority: A; Wattage: 1/16W; PCB Footprint: R0402; Part Type: НЁУГєсД¤µзЧи; Manufacturer PN: RC0402JR-074K7L; Created by: YTL
R6825 = RESISTOR_Dup1: НЁУГєсД¤µзЧи,4K7,+/-5%,R0402,1/16W.; Part Reference: R6825; Manufacturer PN: RC0402JR-074K7L; Manufacturer: YAGEO; Value: 4.7K; Wattage: 1/16W; Priority: A; PCB Footprint: R0402; Created by: YTL; Part Type: НЁУГєсД¤µзЧи; RK PN: RC0402JR-074K7L
R6826 = RESISTOR_Dup1: НЁУГєсД¤µзЧи,4K7,+/-5%,R0402,1/16W.; Part Reference: R6826; Manufacturer PN: RC0402JR-074K7L; Manufacturer: YAGEO; Value: 4.7K; Wattage: 1/16W; Priority: A; PCB Footprint: R0402; Created by: YTL; Part Type: НЁУГєсД¤µзЧи; RK PN: RC0402JR-074K7L
R6827 = RESISTOR_Dup1: НЁУГєсД¤µзЧи,4K7,+/-5%,R0402,1/16W.; Part Reference: R6827; Manufacturer: YAGEO; Value: 4.7K; RK PN: RC0402JR-074K7L; Priority: A; Wattage: 1/16W; PCB Footprint: R0402; Part Type: НЁУГєсД¤µзЧи; Manufacturer PN: RC0402JR-074K7L; Created by: YTL
R6828 = RESISTOR_Dup1: НЁУГєсД¤µзЧи,4K7,+/-5%,R0402,1/16W.; Part Reference: R6828; Manufacturer PN: RC0402JR-074K7L; Manufacturer: YAGEO; Value: 4.7K; Wattage: 1/16W; Priority: A; PCB Footprint: R0402; Created by: YTL; Part Type: НЁУГєсД¤µзЧи; RK PN: RC0402JR-074K7L
R6829 = RESISTOR_Dup1: НЁУГєсД¤µзЧи,4K7,+/-5%,R0402,1/16W.; Part Reference: R6829; Manufacturer: YAGEO; Value: 4.7K; RK PN: RC0402JR-074K7L; Priority: A; Wattage: 1/16W; PCB Footprint: R0402; Part Type: НЁУГєсД¤µзЧи; Manufacturer PN: RC0402JR-074K7L; Created by: YTL
R6830 = RESISTOR_Dup1: НЁУГєсД¤µзЧи,0R,+/-5%,R0402,1/16W.; Part Reference: R6830; Manufacturer PN: RC0402JR-070RL; Manufacturer: YAGEO; Wattage: 1/16W; Priority: A; PCB Footprint: R0402; Value: 0R; Created by: YTL; Part Type: НЁУГєсД¤µзЧи; RK PN: RC0402JR-070RL
R6831 = RESISTOR_Dup1: НЁУГєсД¤µзЧи,4K7,+/-5%,R0402,1/16W.; Part Reference: R6831; Manufacturer PN: RC0402JR-074K7L; Manufacturer: YAGEO; Value: 4.7K; Wattage: 1/16W; Priority: A; PCB Footprint: R0402; Created by: YTL; Part Type: НЁУГєсД¤µзЧи; RK PN: RC0402JR-074K7L
R6832 = RESISTOR_Dup1: НЁУГєсД¤µзЧи,4K7,+/-5%,R0402,1/16W.; Part Reference: R6832; Manufacturer PN: RC0402JR-074K7L; Manufacturer: YAGEO; Value: 4.7K; Wattage: 1/16W; Priority: A; PCB Footprint: R0402; Created by: YTL; Part Type: НЁУГєсД¤µзЧи; RK PN: RC0402JR-074K7L
R6833 = RESISTOR_Dup1: НЁУГєсД¤µзЧи,0R,+/-5%,R0402,1/16W.; Part Reference: R6833; Manufacturer PN: RC0402JR-070RL; Manufacturer: YAGEO; Wattage: 1/16W; Priority: A; PCB Footprint: R0402; Value: 0R; Created by: YTL; Part Type: НЁУГєсД¤µзЧи; RK PN: RC0402JR-070RL
R6834 = RESISTOR_Dup1: НЁУГєсД¤µзЧи,4K7,+/-5%,R0402,1/16W.; Part Reference: R6834; Manufacturer PN: RC0402JR-074K7L; Manufacturer: YAGEO; Value: 4.7K; Wattage: 1/16W; Priority: A; PCB Footprint: R0402; Created by: YTL; Part Type: НЁУГєсД¤µзЧи; RK PN: RC0402JR-074K7L
R6835 = RESISTOR_Dup1: НЁУГєсД¤µзЧи,1K8,+/-5%,R0402,1/16W.; Part Reference: R6835; Manufacturer PN: RC0402JR-071K8L; Manufacturer: YAGEO; Value: 1.8K; Wattage: 1/16W; Priority: A; PCB Footprint: R0402; Created by: YTL; Part Type: НЁУГєсД¤µзЧи; RK PN: RC0402JR-071K8L
R6836 = RESISTOR_Dup1: НЁУГєсД¤µзЧи,0R,+/-5%,R0402,1/16W.; Part Reference: R6836; Manufacturer: YAGEO; RK PN: RC0402JR-070RL; Priority: A; Wattage: 1/16W; PCB Footprint: R0402; Value: 0R; Part Type: НЁУГєсД¤µзЧи; Manufacturer PN: RC0402JR-070RL; Created by: YTL
R6837 = RESISTOR_Dup1: НЁУГєсД¤µзЧи,22R,+/-5%,R0402,1/16W.; Part Reference: R6837; Manufacturer PN: RC0402JR-0722RL; Manufacturer: YAGEO; Wattage: 1/16W; Priority: A; PCB Footprint: R0402; Value: 22R; Created by: YTL; Part Type: НЁУГєсД¤µзЧи; RK PN: RC0402JR-0722RL
R6838 = RESISTOR_Dup1: НЁУГєсД¤µзЧи,22R,+/-5%,R0402,1/16W.; Part Reference: R6838; Manufacturer: YAGEO; RK PN: RC0402JR-0722RL; Priority: A; Wattage: 1/16W; PCB Footprint: R0402; Value: 22R; Part Type: НЁУГєсД¤µзЧи; Manufacturer PN: RC0402JR-0722RL; Created by: YTL
R6839 = RESISTOR_Dup1: НЁУГєсД¤µзЧи,22R,+/-5%,R0402,1/16W.; Part Reference: R6839; Manufacturer: YAGEO; RK PN: RC0402JR-0722RL; Priority: A; Wattage: 1/16W; PCB Footprint: R0402; Value: 22R; Part Type: НЁУГєсД¤µзЧи; Manufacturer PN: RC0402JR-0722RL; Created by: YTL
R6840 = RESISTOR_Dup1: НЁУГєсД¤µзЧи,22R,+/-5%,R0402,1/16W.; Part Reference: R6840; Manufacturer: YAGEO; RK PN: RC0402JR-0722RL; Priority: A; Wattage: 1/16W; PCB Footprint: R0402; Value: 22R; Part Type: НЁУГєсД¤µзЧи; Manufacturer PN: RC0402JR-0722RL; Created by: YTL
R6841 = RESISTOR_Dup1: НЁУГєсД¤µзЧи,22R,+/-5%,R0402,1/16W.; Part Reference: R6841; Manufacturer: YAGEO; RK PN: RC0402JR-0722RL; Priority: A; Wattage: 1/16W; PCB Footprint: R0402; Value: 22R; Part Type: НЁУГєсД¤µзЧи; Manufacturer PN: RC0402JR-0722RL; Created by: YTL
R6842 = RESISTOR_Dup1: НЁУГєсД¤µзЧи,22R,+/-5%,R0402,1/16W.; Part Reference: R6842; Manufacturer: YAGEO; RK PN: RC0402JR-0722RL; Priority: A; Wattage: 1/16W; PCB Footprint: R0402; Value: 22R; Part Type: НЁУГєсД¤µзЧи; Manufacturer PN: RC0402JR-0722RL; Created by: YTL
TP6800 = TP: Test Point 0.7mm; Part Reference: TP6800; PCB Footprint: TP_0R70; Value: TP_0.7; Priority: A; RK PN: TESTPOINT_0R7; Created by: JJJ; Part Type: TP
U6800 = Ethernet_H5007: Gigabit Ethernet (1000Base-T); Part Reference: U6800; Manufacturer: Pulse; Value: H5007; Priority: A; PCB Footprint: SOIC24_17R53X12R20X5R51; Created by: JJJ; Manufacturer PN: H5007; Part Type: Ethernet; RK PN: H5007
U6801 = Ethernet_RTL8211F: Integrated 10/100/1000 Gigabit Ethernet TransceiverЈ¬Supports IEEE 802.3az-2010,; Part Reference: U6801; Manufacturer: RealTek(ИркЕ); Value: RTL8211F-CG; Priority: A; RK PN: RTL8211F-CG; Part Type: Ethernet; Manufacturer PN: RTL8211F-CG; Created by: JJJ
Y6800 = CRYSTAL_4P: ОЮФґѕ§ХсЈ¬25MЈ¬3225,ЎА10ppmЈ¬10pFЈ¬Hosonic; Part Reference: Y6800; Manufacturer: Hosonic(єиРЗµзЧУ); Value: 25MHz; RK PN: E3SB25.0000F10E11; Priority: A; Part Type: CRYSTAL; Manufacturer PN: E3SB25.0000F10E11; Created by: JJJ